# EasyEDA schematic SCH_Arduino Uno_2023-06-21.json
TITLE: Arduino Uno; REV: 1.0; Date: 2023-06-16; Sheet: 1/1; Drawn By: Rayan Eid Albalawi; Company: Tabuk University
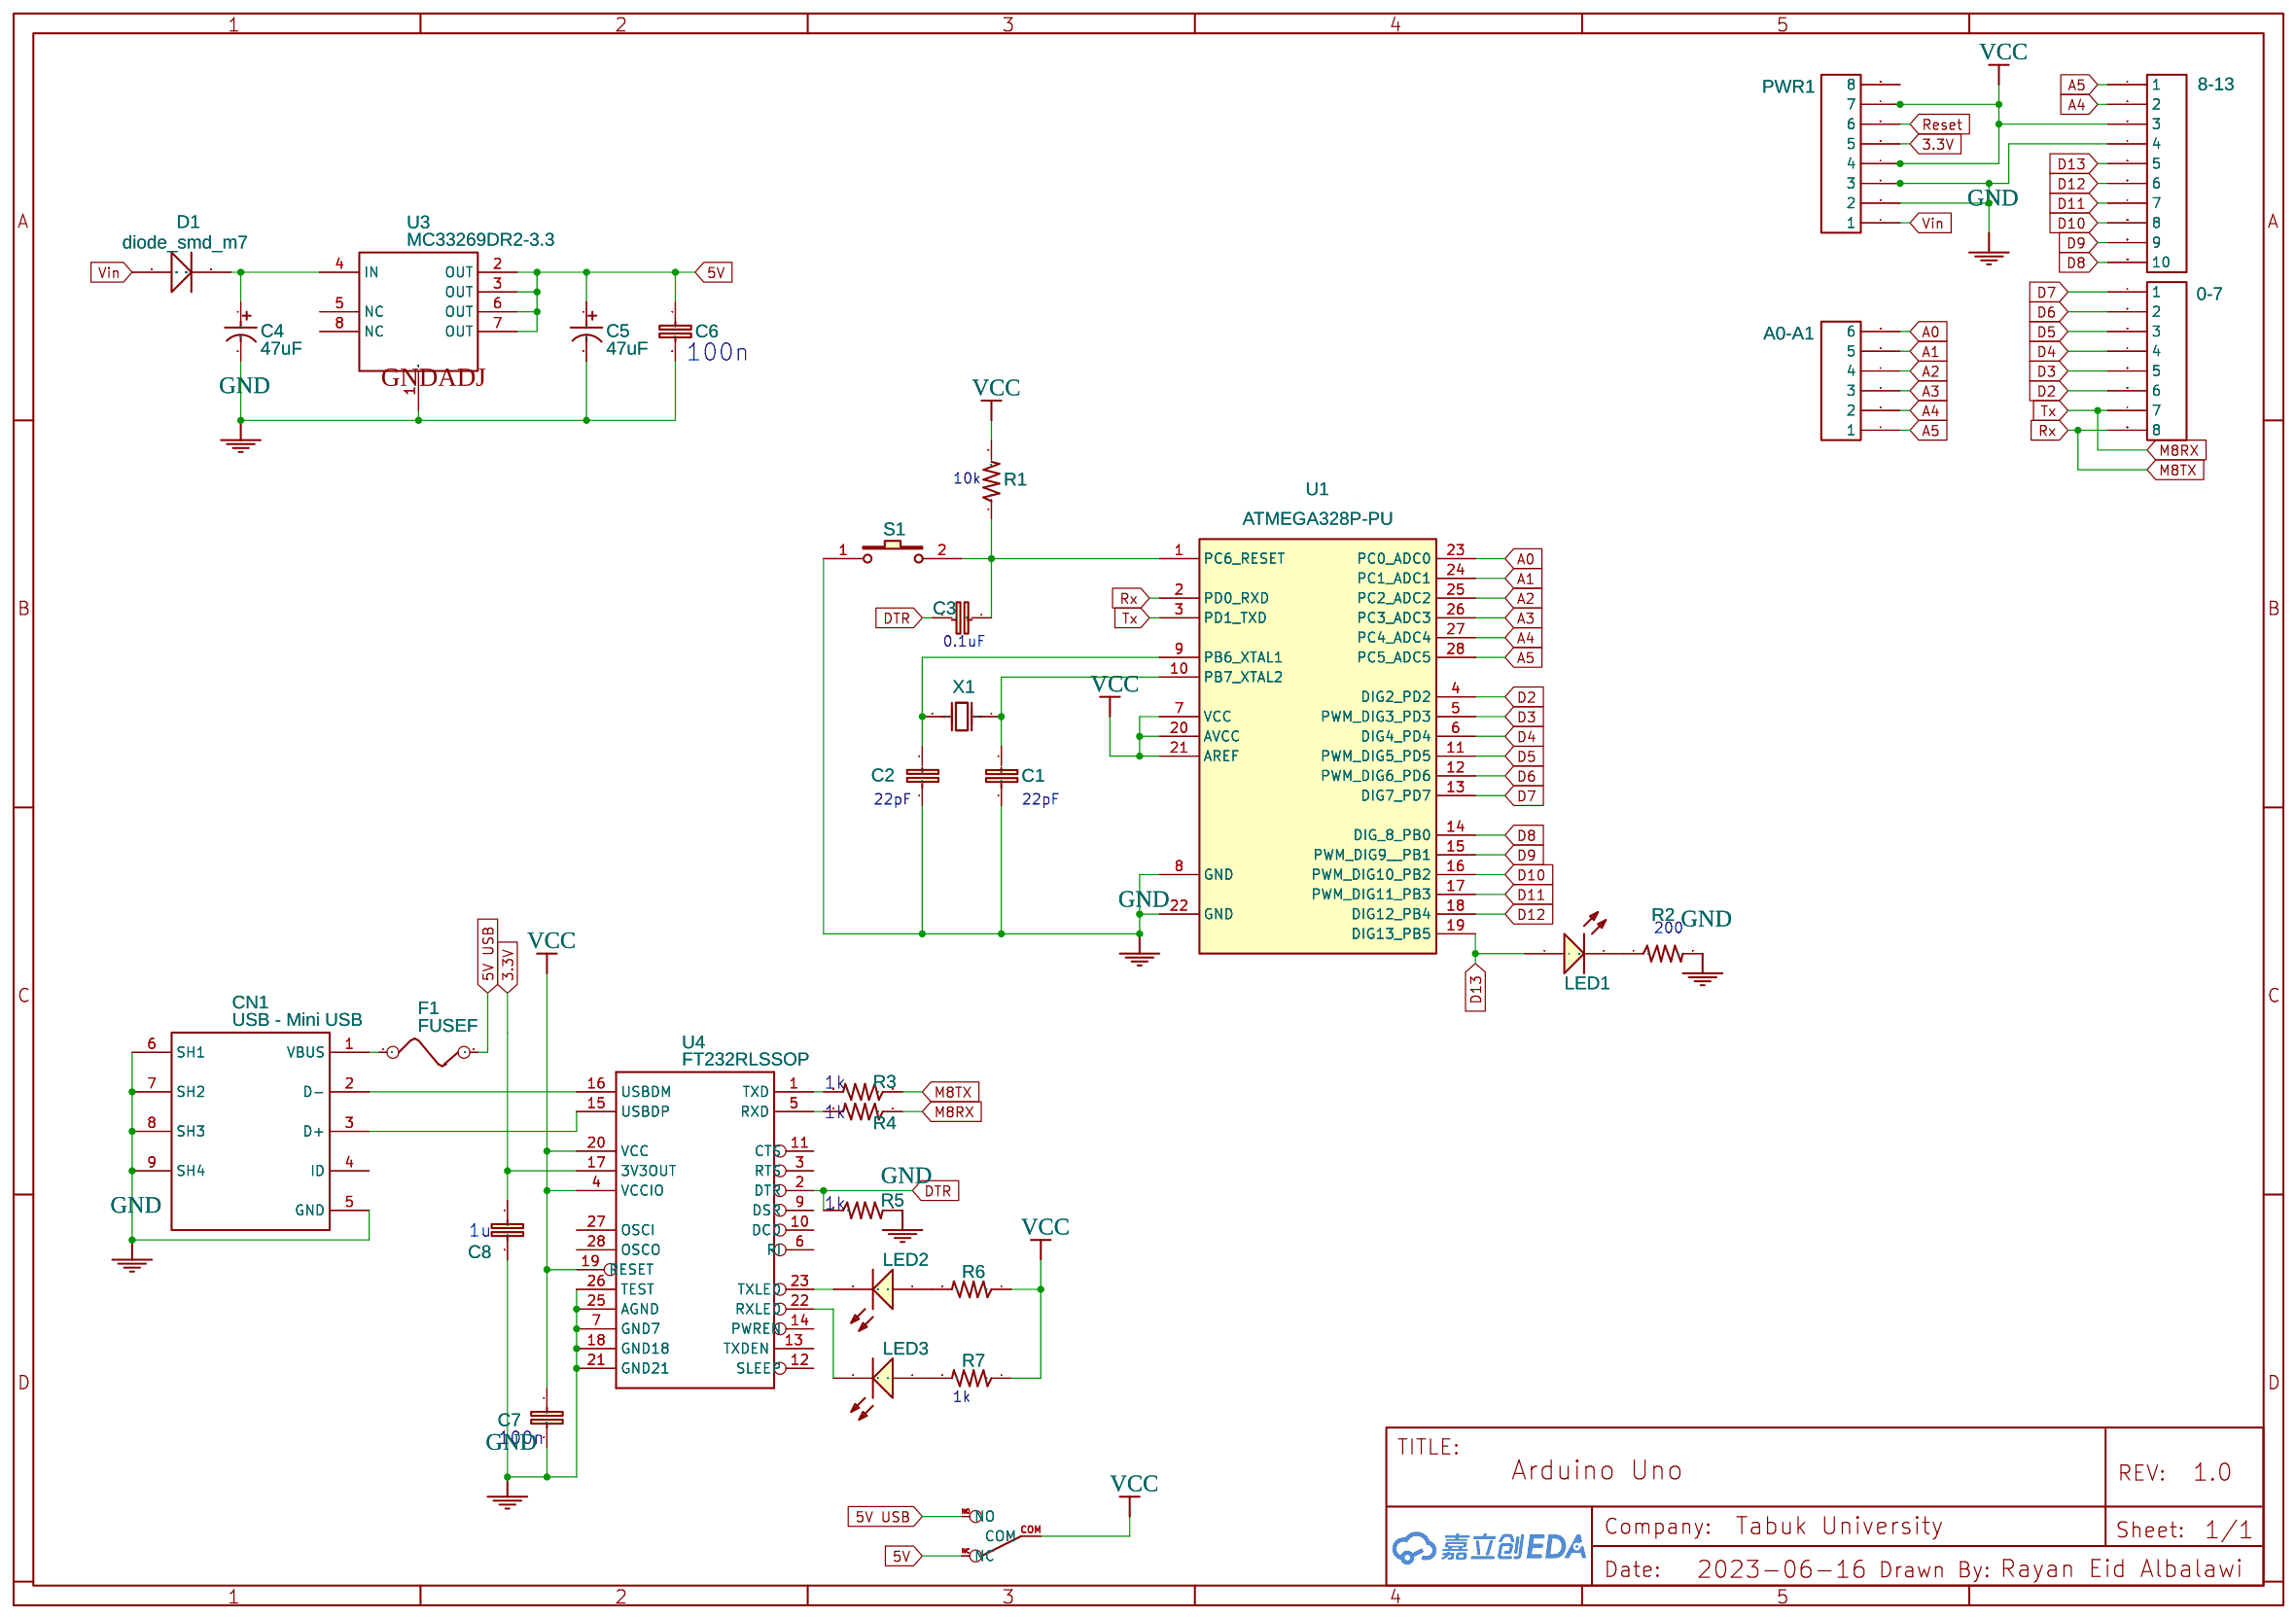
[diagram p0: schematic sheet]

## Parts
0-7  0-7  [HDR-8X1/2.54]
8-13  8-Aref  [HDR-10X1/2.54]
A0-A1  Analogs  [HDR-6X1/2.54]
C1  CAPACITOR_NPOL-0805  [C805]
C2  CAPACITOR_NPOL-0805  [C805]
C3  CAPACITOR_NPOL-0805  [C805]
C4  47uF  [PANASONIC SMD CAP SIZE D]
C5  47uF  [PANASONIC SMD CAP SIZE D]
C6  CAPACITOR_NPOL-0805  [C805]
C7  CAPACITOR_NPOL-0805  [C805]
C8  CAPACITOR_NPOL-0805  [C805]
CN1  USB - Mini USB  [MINI USB]
D1  diode_smd_m7  [DIODE_SMD_M7]
F1  FUSEF  [1812]
LED1  17-21/GHC-YR1S2/3T  [LED-0805]
LED2  17-21/GHC-YR1S2/3T  [LED-0805]
LED3  17-21/GHC-YR1S2/3T  [LED-0805]
PWR1  Powers  [HDR-8X1/2.54]
R1  0.22OHM-1_4W-1%(0805)  [0805]
R2  200  [0805]
R3  200  [0805]
R4  200  [0805]
R5  200  [0805]
R6  200  [0805]
R7  200  [0805]
S1  Button1  [SMD PUSH BUTTON]
SW1  SW-SLIDE  [SLIDE_SWITCH_SMD]
U1  ATMEGA328P-PU  [DIP-28_300MIL]
U3  MC33269DR2-3.3  [SOIC-8_150MIL]
U4  FT232RLSSOP  [SSOP28DB]
X1  16MHZ  [OSC-49S-1]

## Library data of the parts
0-7 PWR1 = -: Supplier: LCSC; Manufacturer: ReliaPro; Manufacturer Part: Header2.54mm 1*8P; image: http://image.lceda.cn/szlcsc/C49256.jpg
8-13 = -: Supplier: LCSC; Manufacturer: ReliaPro; Manufacturer Part: Headers  Pins2.54mm1*10P; image: http://image.lceda.cn/szlcsc/C57369.jpg
A0-A1 = -: Supplier: LCSC; Manufacturer: BOOMELE; Manufacturer Part: Header-Male-2.54_1x6; Supplier Part: C37208
C1-C3 C6-C8 = -: Non-Polarized capacitor in various packages; catid: 20; Contributor: DangerousPrototype; Manufacturer Part: ?
C4 C5 = -: Voltage: 63V; Tolerance: ±20%; Supplier: Mouser; Manufacturer: Panasonic; Manufacturer Part: EEE-HD1C470AP; LCSC: C82011
CN1 = -: link: https://www.es.co.th/Schemetic/PDF/MUMRB05FTKN.PDF; Contributor: suwanp
D1 = diode_smd_m7: Contributor: kova128388; Manufacturer Part: ?
F1 = -: Manufacturer Part: ?
LED1-LED3 = -: Supplier: EasyEDA; Manufacturer: EVERLIGHT; Supplier Part: E73546
R1-R7 = -: RES-09883; catid: 20; Contributor: SparkFun; Manufacturer Part: ?
S1 = -: catid: 20; sourceId: K60iAuM3l; Manufacturer Part: ?
SW1 = -: Contributor: DangerousPrototype; sourceId: UQOaKjhfd; Manufacturer Part: ?
U1 = -: catid: 20; sourceId: Oic6oiASL; Supplier: LCSC; Manufacturer: ATMEL; Supplier Part: C33901
U3 = -: Supplier: LCSC; Manufacturer: ON; image: //image.lceda.cn/szlcsc/C7301.jpg; Supplier Part: C7301
U4 = -: USB UART; Contributor: SparkFun; Manufacturer Part: ?
X1 = -: Supplier: LCSC; Manufacturer: YXC; Manufacturer Part: X49SD16MSD2SC; Supplier Part: C16212

## Nets
3.3V: C8.1 PWR1.5 U4.17(3V3OUT)
5V: C5.1 C6.1 SW1.NC U3.2(OUT) U3.3(OUT) U3.6(OUT) U3.7(OUT)
5V USB: F1.2 SW1.NO
GND: 8-13.4 C1.2 C2.1 C4.2 C5.2 C6.2 C7.2 C8.2 CN1.5(GND) CN1.6(SH1) CN1.7(SH2) CN1.8(SH3) CN1.9(SH4) PWR1.2 PWR1.3 R2.2 R5.2 S1.1 U1.8(GND) U1.22(GND) U3.1(GNDADJ) U4.7(GND7) U4.18(GND18) U4.21(GND21) U4.25(AGND) U4.26(TEST)
VCC: 8-13.3 C7.1 PWR1.4 PWR1.7 R1.2 R6.1 R7.1 SW1.COM U1.7(VCC) U1.20(AVCC) U1.21(AREF) U4.4(VCCIO) U4.19(RESET) U4.20(VCC)
Vin: D1.2(анод) PWR1.1
A0: A0-A1.6 U1.23(PC0 ADC0)
A1: A0-A1.5 U1.24(PC1 ADC1)
A2: A0-A1.4 U1.25(PC2 ADC2)
A3: A0-A1.3 U1.26(PC3 ADC3)
A4: 8-13.2 A0-A1.2 U1.27(PC4 ADC4)
A5: 8-13.1 A0-A1.1 U1.28(PC5 ADC5)
D2: 0-7.6 U1.4(DIG2 PD2)
D3: 0-7.5 U1.5(PWM DIG3 PD3)
D4: 0-7.4 U1.6(DIG4 PD4)
D5: 0-7.3 U1.11(PWM DIG5 PD5)
D6: 0-7.2 U1.12(PWM DIG6 PD6)
D7: 0-7.1 U1.13(DIG7 PD7)
D8: 8-13.10 U1.14(DIG 8 PB0)
D9: 8-13.9 U1.15(PWM DIG9  PB1)
D10: 8-13.8 U1.16(PWM DIG10 PB2)
D11: 8-13.7 U1.17(PWM DIG11 PB3)
D12: 8-13.6 U1.18(DIG12 PB4)
D13: 8-13.5 LED1.1(A) U1.19(DIG13 PB5)
DTR: C3.1 R5.1 U4.2(DTR)
M8RX: 0-7.7 R4.1 U1.3(PD1 TXD)
M8TX: 0-7.8 R3.1 U1.2(PD0 RXD)
Reset: PWR1.6
Net-(C1-1): C1.1 U1.10(PB7 XTAL2) X1.1(OSC1)
Net-(C2-2): C2.2 U1.9(PB6 XTAL1) X1.2(OSC2)
Net-(C3-2): C3.2 R1.1 S1.2 U1.1(PC6 RESET)
Net-(C4-1): C4.1 D1.1(катод) U3.4(IN)
Net-(CN1-1): CN1.1(VBUS) F1.1
Net-(CN1-2): CN1.2(D-) U4.16(USBDM)
Net-(CN1-3): CN1.3(D+) U4.15(USBDP)
Net-(LED1-2): LED1.2(C) R2.1
Net-(LED2-1): LED2.1(A) R6.2
Net-(LED2-2): LED2.2(C) U4.23(TXLED)
Net-(LED3-1): LED3.1(A) R7.2
Net-(LED3-2): LED3.2(C) U4.22(RXLED)
Net-(R3-2): R3.2 U4.1(TXD)
Net-(R4-2): R4.2 U4.5(RXD)

Not connected (* = marked no-connect by the designer): CN1 4(ID); PWR1 8; U3 5(NC) 8(NC); U4 3(RTS) 6(RI) 9(DSR) 10(DCD) 11(CTS) 12(SLEEP) 13(TXDEN) 14(PWREN) 27(OSCI) 28(OSCO)

## Notes on the sheet
- 100n
- 10k
- 0.1uF
- 22pF
- 22pF
- 200
- 1k
- 1k
- 1k
- 1u
- 1k
- 100n
